# Altium schematic sheet PG4 SHEET2.schdoc
size B; Date: 2/10/2009; ApprovedBy: Touraj; DrawnBy: Juan A. Nadal; Engineer: Touraj; Organization: ActiveWave; Address1: 902 Clint Moore Rd., Suite 118; Address2: Boca Raton; Address3: FL, 33487; Address4: 561-999-9422; DocumentNumber: 4; Revision: 20; SheetNumber: 4; SheetTotal: 4; PageSetup: Record=PageOptions|CenterHorizontal=True|CenterVertical=True|PrintScale=0.70|XCorrection=1.00|YCorrection=1.00|PrintKind=0|BorderSize=5000000|LeftOffset=0|BottomOffset=0|Orientation=2|PaperLength=1000|PaperWidth=1000|Scale=100|PaperSource=7|PrintQuality=-4|MediaType=1|DitherType=10|PaperKind=Letter|PrintScaleMode=1; Project: Tag103
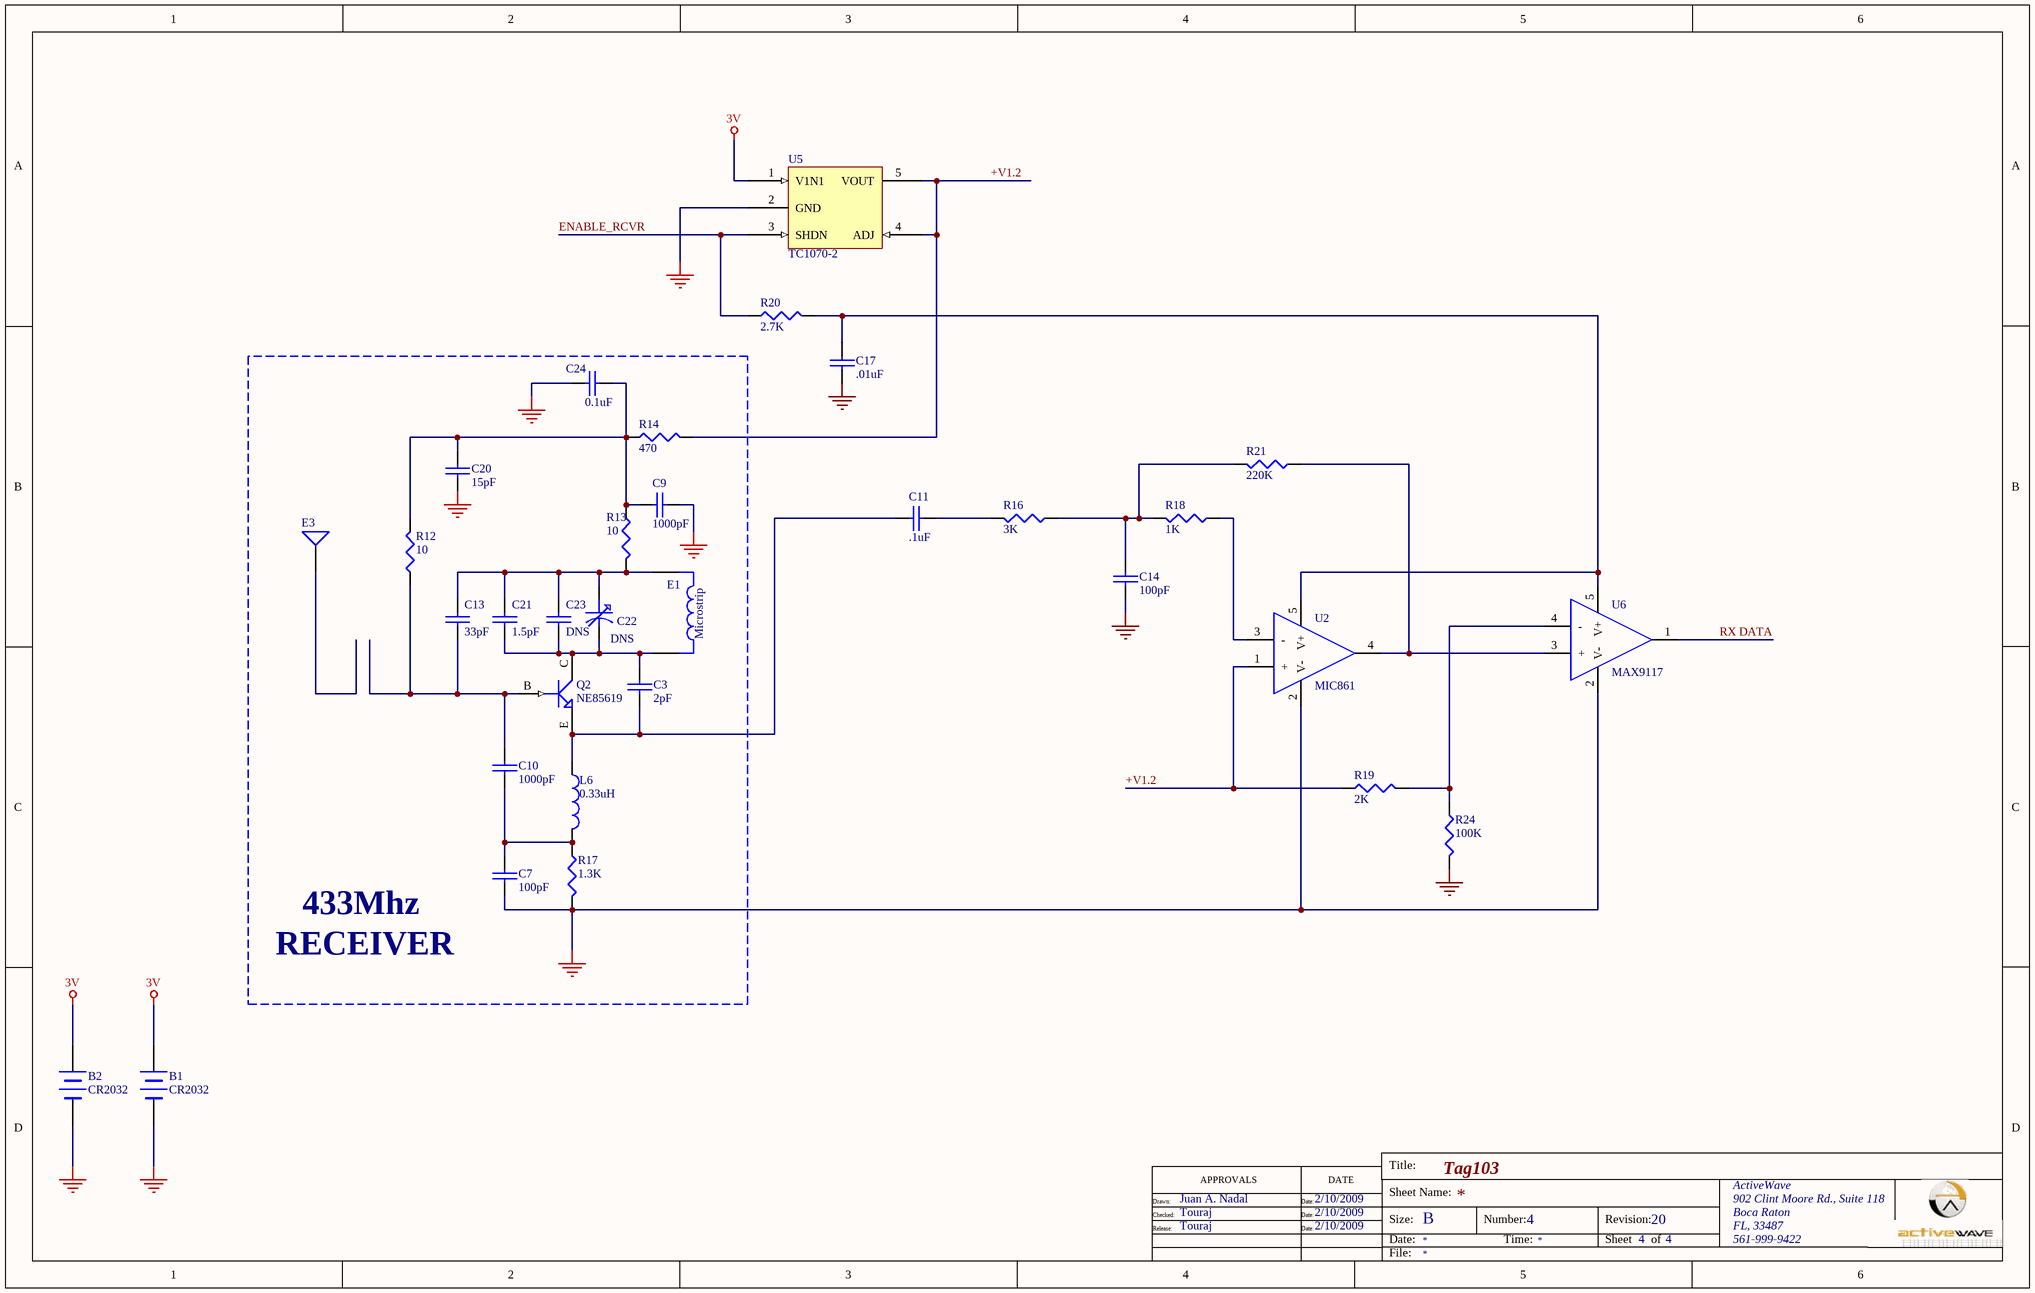
[diagram p0: PG4 SHEET2.schdoc]

## Parts
B1  value CR2032  [BATT HOLDER1]  (hidden comment: BATT HOLDER COIN CR2032 CUT)
B2  value CR2032  [BATT HOLDER COIN CR2032 CUT_VER1]  (hidden comment: BATT HOLDER COIN CR2032 CUT)
C3  value 2pF  [0603]  (hidden comment: 2 pF)
C7  value 100pF  [0603]  (hidden comment: 100 pF)
C9  value 1000pF  [0603]  (hidden comment: 1000 pF)
C10  value 1000pF  [0603]  (hidden comment: 1000 pF)
C11  .1uF  [0603]
C13  value 33pF  [0603]  (hidden comment: 33 pF)
C14  100pF  [0603]
C17  .01uF  [0603]
C20  15pF  [0603]
C21  1.5pF  [0603]
C22  DNS  [0603]
C23  DNS  [0603]
C24  value 0.1uF  [0603]  (hidden comment: 0.1 uF)
E1  Microstrip  [Antenna]  (net tie, no BOM)
E3  *  [Antenna1]  (value not drawn)
L6  0.33uH  [0603]
Q2  NE85619  [3 PIN ULTRA SUPER MINI MOLD]
R12  10  [0603]
R13  10  [0603]
R14  470  [0603]
R16  value 3K  [0603]  (hidden comment: 22K)
R17  value 1.3K  [0603]  (hidden comment: 2K)
R18  1K  [0603]
R19  2K  [0603]
R20  2.7K  [0603]
R21  220K  [0603]
R24  100K  [0603]
U2  MIC861  [SC70]
U5  value TC1070-2  [SOT23-5A]  (hidden comment: TC1070)
U6  value MAX9117  [SC70]  (hidden comment: MAX9119EXK+)

## Nets
3V: B1.2(+) B2.2(+) U5.1(V1N1)
GND: B1.1(-) B2.1(-) C7.2 C9.2 C14.1 C17.2 C20.2 C24.2 R17.2 R24.2 U2.2(V-) U5.2(GND) U6.2(V-)
+V1.2: R14.2 R19.1 U2.1(+) U5.4(ADJ) U5.5(VOUT)
ENABLE_RCVR: R20.1 U5.3(SHDN)
RX DATA: U6.1(OUT)
NetC3_1: C3.1 C21.2 C22.2 C23.2 E1.2 Q2.C
NetC3_2: C3.2 C11.1 L6.1 Q2.E
NetC7_1: C7.1 C10.2 L6.2 R17.1
NetC9_1: C9.1 C20.1 C24.1 R12.2 R13.1 R14.1
NetC10_1: C10.1 C13.2 Q2.B R12.1
NetC11_2: C11.2 R16.2
NetC13_1: C13.1 C21.1 C22.1 C23.1 E1.1 R13.2
NetC14_2: C14.2 R16.1 R18.2 R21.2
NetC17_1: C17.1 R20.2 U2.5(V+) U6.5(V+)
NetR18_1: R18.1 U2.3(-)
NetR19_2: R19.2 R24.1 U6.4(-)
NetR21_1: R21.1 U2.4(OUT) U6.3(+)

Not connected (* = marked no-connect by the designer): E3 1

## Notes on the sheet
- RECEIVER
- 433Mhz
- APPROVALS
- DATE
- Title:
- Drawn:
- Checked:
- Release:
- Date:
- Size:
- Sheet Name:
- B
- Number:
- Time:
- Revision:
- Sheet
- of
- File:

## Library data of the parts
B1 B2 = BATTERY2: Battery; ACTIVEWAVE-P/N: *; ITEM-DESCRIPTION: *; MANUFACTURER: *; MFGR-P/N: *
C3 C7 C9-C11 C13 C14 C17 C20 C21 C23 C24 = CAP-0603: Capacitor; ACTIVEWAVE-P/N: *; ITEM-DESCRIPTION: *; MANUFACTURER: *; MFGR-P/N: *
  C11: VALUE: .1uF
  C14: VALUE: 100pF
  C17: VALUE: .01uF
  C20: VALUE: 15pF
  C21: VALUE: 1.5pF
  C23: VALUE: DNS
C22 = CAPACITOR VAR: Text Field1: 20; Text Field2: 20
E1 = ANTENNA: PART-VALUE: *; ITEM-DESCRIPTION: Microstrip
E3 = Antenna1: PART-VALUE: *
L6 = INDUCTOR: ACTIVEWAVE-P/N: *; ITEM-DESCRIPTION: *; MANUFACTURER: *; MFGR-P/N: *; VALUE: 0.33uH
Q2 = NE85619: NPN Transistor; ACTIVEWAVE-P/N: *; ITEM-DESCRIPTION: *; MANUFACTURER: *; MFGR-P/N: *; VALUE: NE85619
R12-R14 R16-R21 R24 = RES-0603: ACTIVEWAVE-P/N: *; MFGR-P/N: *; MANUFACTURER: *; ITEM-DESCRIPTION: *
  R12 R13: VALUE: 10
  R14: VALUE: 470
  R18: VALUE: 1K
  R19: VALUE: 2K
  R20: VALUE: 2.7K
  R21: VALUE: 220K
  R24: VALUE: 100K
U2 = OPAMP MIC861: ACTIVEWAVE-P/N: *; ITEM-DESCRIPTION: *; MANUFACTURER: *; MFGR-P/N: *; VALUE: MIC861
U5 = TC1070-2: ACTIVEWAVE-P/N: *; ITEM-DESCRIPTION: *; MANUFACTURER: *; MFGR-P/N: *
U6 = COMPARATOR MAX9117: ACTIVEWAVE-P/N: *; ITEM-DESCRIPTION: *; MANUFACTURER: *; MFGR-P/N: *